# EAGLE design NanoLogger_V2 (EAGLE 6.1)
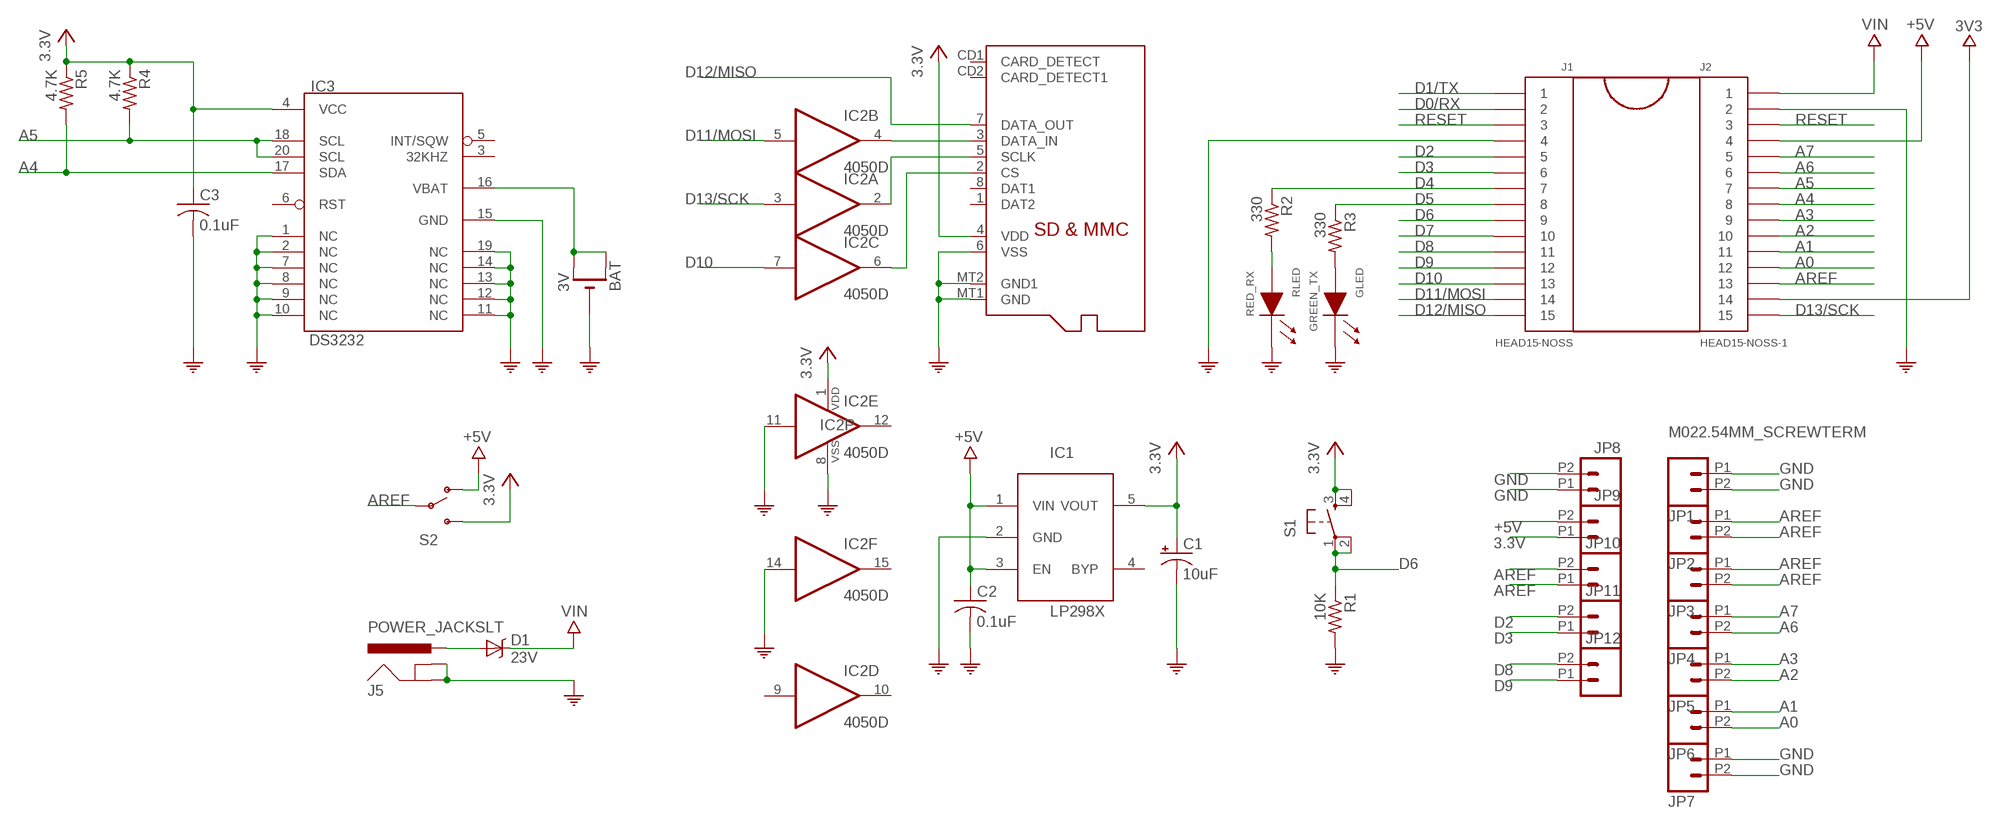
[diagram p0: schematic, sheet 1]

## Parts
BAT  3V  CR1220SMT  [CR1220-SMD]
C1  10uF  CPOL-USA/3216-18R  [A/3216-18R]
C2  0.1uF  C-USC0805K  [C0805K]
C3  0.1uF  C-USC0805K  [C0805K]
D1  23V  BAT20JFILM  [SOD-323]
GLED  GREEN_TX  LED0805  [LED0805]
IC1  LP298XS  [SOT23-5L]
IC2  4050D  [SO16]
IC3  DS3232  [SO20L]
J1  HEAD15-NOSS  [HEAD15-NOSS]
J2  HEAD15-NOSS-1  [HEAD15-NOSS-1]
J5  POWER_JACKSLT  [POWER_JACK_SLOT]
JP1  M022.54MM_SCREWTERM  [1X02_2.54_SCREWTERM]
JP2  M022.54MM_SCREWTERM  [1X02_2.54_SCREWTERM]
JP3  M022.54MM_SCREWTERM  [1X02_2.54_SCREWTERM]
JP4  M022.54MM_SCREWTERM  [1X02_2.54_SCREWTERM]
JP5  M022.54MM_SCREWTERM  [1X02_2.54_SCREWTERM]
JP6  M022.54MM_SCREWTERM  [1X02_2.54_SCREWTERM]
JP7  M022.54MM_SCREWTERM  [1X02_2.54_SCREWTERM]
JP8  M022.54MM_SCREWTERM  [1X02_2.54_SCREWTERM]
JP9  M022.54MM_SCREWTERM  [1X02_2.54_SCREWTERM]
JP10  M022.54MM_SCREWTERM  [1X02_2.54_SCREWTERM]
JP11  M022.54MM_SCREWTERM  [1X02_2.54_SCREWTERM]
JP12  M022.54MM_SCREWTERM  [1X02_2.54_SCREWTERM]
R1  10K  R-US_R0805  [R0805]
R2  330  R-US_R0805  [R0805]
R3  330  R-US_R0805  [R0805]
R4  4.7K  R-US_R0805  [R0805]
R5  4.7K  R-US_R0805  [R0805]
RLED  RED_RX  LED0805  [LED0805]
S1  TAC_SWITCHSMD  [TACTILE_SWITCH_SMD]
S2  SWITCH-SPDTPTH  [SWITCH-SPDT]
X1  MICROSD  [MICROSD]

## Nets
3.3V: C1.+ C3.1 IC1.5(VOUT) IC2.1(P:VDD) IC3.4(VCC) JP9.P1 R4.1 R5.1 S1.3 S1.4 S2.3(S) X1.4(VDD)
3V3: J2.14
+5V: C2.1 IC1.1(VIN) IC1.3(EN) J2.4 JP9.P2 S2.1(O)
A0: J2.12 JP6.P2
A1: J2.11 JP6.P1
A2: J2.10 JP5.P2
A3: J2.9 JP5.P1
A4: IC3.17(SDA) J2.8 R5.2
A5: IC3.18(SCL) IC3.20(SCL) J2.7 R4.2
A6: J2.6 JP4.P2
A7: J2.5 JP4.P1
AREF: J2.13 JP2.P1 JP2.P2 JP3.P1 JP3.P2 JP10.P1 JP10.P2 S2.2(P)
BAT_POWER: D1.2(A) J5.PWR
D0/RX: J1.2
D1/TX: J1.1
D2: J1.5 JP11.P2
D3: J1.6 JP11.P1
D4: J1.7 R2.1
D5: J1.8 R3.1
D6: J1.9 R1.1 S1.1 S1.2
D7: J1.10
D8: J1.11 JP12.P2
D9: J1.12 JP12.P1
D10: IC2.7(C:I) J1.13
D11/MOSI: IC2.5(B:I) J1.14
D12/MISO: J1.15 X1.7(DATA_OUT)
D13/SCK: IC2.3(A:I) J2.15
GND: BAT.- C1.- C2.2 C3.2 GLED.1(CA) IC1.2(GND) IC2.8(P:VSS) IC2.11(E:I) IC2.14(F:I) IC3.1(NC) IC3.2(NC) IC3.7(NC) IC3.8(NC) IC3.9(NC) IC3.10(NC) IC3.11(NC) IC3.12(NC) IC3.13(NC) IC3.14(NC) IC3.15(GND) IC3.19(NC) J1.4 J2.2 J5.GND@1(GNDBREAK) J5.GND@2(GND) JP1.P1 JP1.P2 JP7.P1 JP7.P2 JP8.P1 JP8.P2 R1.2 RLED.1(CA) X1.6(VSS) X1.MT1(GND) X1.MT2(GND1) ; supply symbol labelled COM
N$2: IC2.2(A:O) X1.5(SCLK)
N$3: IC2.6(C:O) X1.2(CS)
N$5: IC2.4(B:O) X1.3(DATA_IN)
N$6: GLED.2(AN) R3.2
N$7: R2.2 RLED.2(AN)
RESET: J1.3 J2.3
VBAT: BAT.+$1(+) BAT.+$2(+1) IC3.16(VBAT)
VIN: D1.1(C) J2.1
Unconnected: IC1.4(BYP) IC2.9(D:I) IC2.10(D:O) IC2.12(E:O) IC2.15(F:O) IC3.3(32KHZ) IC3.5(INT/SQW) IC3.6(RST) X1.1(DAT2) X1.8(DAT1) X1.CD1(CARD_DETECT) X1.CD2(CARD_DETECT1)

## Library data of the parts
BAT = adafruit:CR1220: CR1216/CR1220/CR1225 12mm 3V lithium coin cell Great for battery packup. Both SMT and THM holders. Note the THM package has the ground pads on both sides of the PCB so that the masks are the same - this reduces the cost
C1 = adafruit:CPOL-US: POLARIZED CAPACITOR, American symbol
C2 C3 = adafruit:C-US: CAPACITOR, American symbol
D1 = SparkFun-DiscreteSemi:BAT20JFILM: 23V, 1A Schottky diode, SOD-323 package; PROD_ID: DIO-11623; VALUE: BAT20JFILM
GLED RLED = MySMD:LED0805
IC1 = adafruit:LP298X
IC2 = 40xx:4050: Hex non-inverting BUFFER
IC3 = freetronics-master-v1:DS3232: DS3232 Extremely Accurate I2C RTC with Integrated Crystal and SRAM
J1 = MyCON2:HEAD15-NOSS
J2 = MyCON2:HEAD15-NOSS-1
J5 = SparkFun-Connectors:POWER_JACK: Power Jack This is the standard 5.5mm barrel jack for power. The PTH is the most common, proven, reliable, footprint. The Slot footprint only works if the mill layer is transmitted to the PCB fab house so be warned. Spark Fun Electronics SKU : PRT-00119 SMT: CONN-08106 Mating wall wart : TOL-00298 (and others)
JP1-JP12 = SparkFun-Connectors:M02: Standard 2-pin 0.1" header. Use with - straight break away headers ( PRT-00116) - right angle break away headers (PRT-00553) - swiss pins (PRT-00743) - machine pins (PRT-00117) - female headers (PRT-00115) Molex polarized connector foot print use with: PRT-08233 with associated crimp pins and housings. 2.54_SCREWTERM for use with PRT-10571. 3.5mm Screw Terminal footprints for PRT-08084 5mm Screw Terminal footprints for use with PRT-08433
R1-R5 = adafruit:R-US_: RESISTOR, American symbol
S1 = SparkFun-Electromechanical:TAC_SWITCH: Momentary Switch Button commonly used for reset or general input. Spark Fun Electronics SKU : COM-00097 SMT- SWCH-08247; PROD_ID: SWCH-08247
S2 = Sparkfun SPDT Switch slider COM-0960:SWITCH-SPDT: SPDT Switch Simple slide switch, Spark Fun Electronics SKU : COM-00102 DPDT SMT slide switch, AYZ0202, SWCH-08179
X1 = adafruit:MICROSD: Micro-SD / Transflash card holder with SPI pinout For the 3M # 2908-05WB-MG and/or 4UCON #19656 push-push type

## Net classes
0 default: width 0.305 mm, clearance 0.305 mm
1 GND: width 0.305 mm, clearance 0.305 mm
2 +5V: width 0.406 mm, clearance 0.305 mm
3 3.3V: width 0.406 mm, clearance 0.305 mm
4 3V3: width 0.406 mm, clearance 0.305 mm
5 BAT_POWER: width 0.406 mm, clearance 0.305 mm

## Board
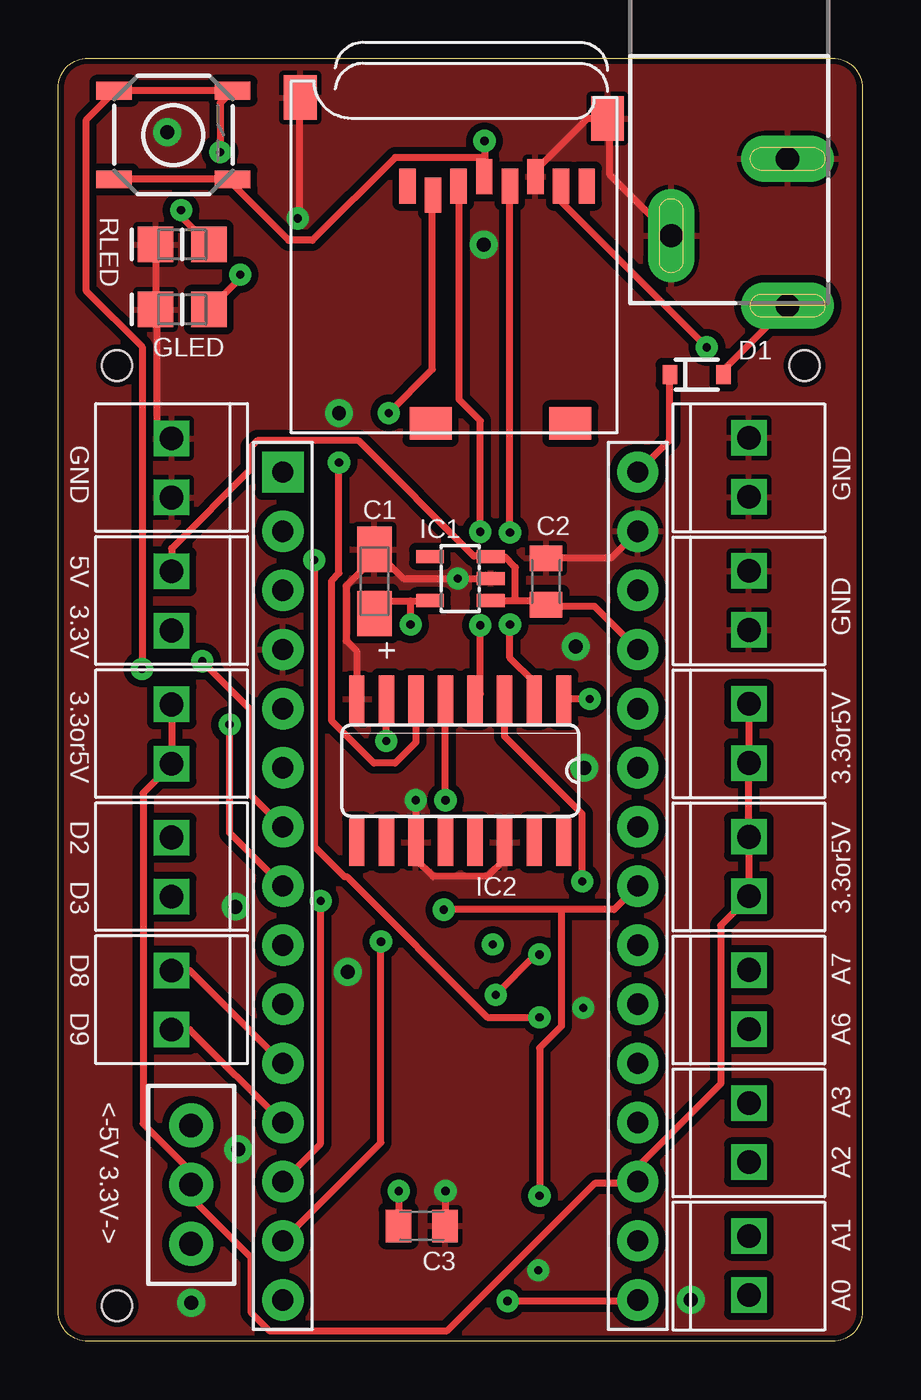
[diagram p1: board, top side]
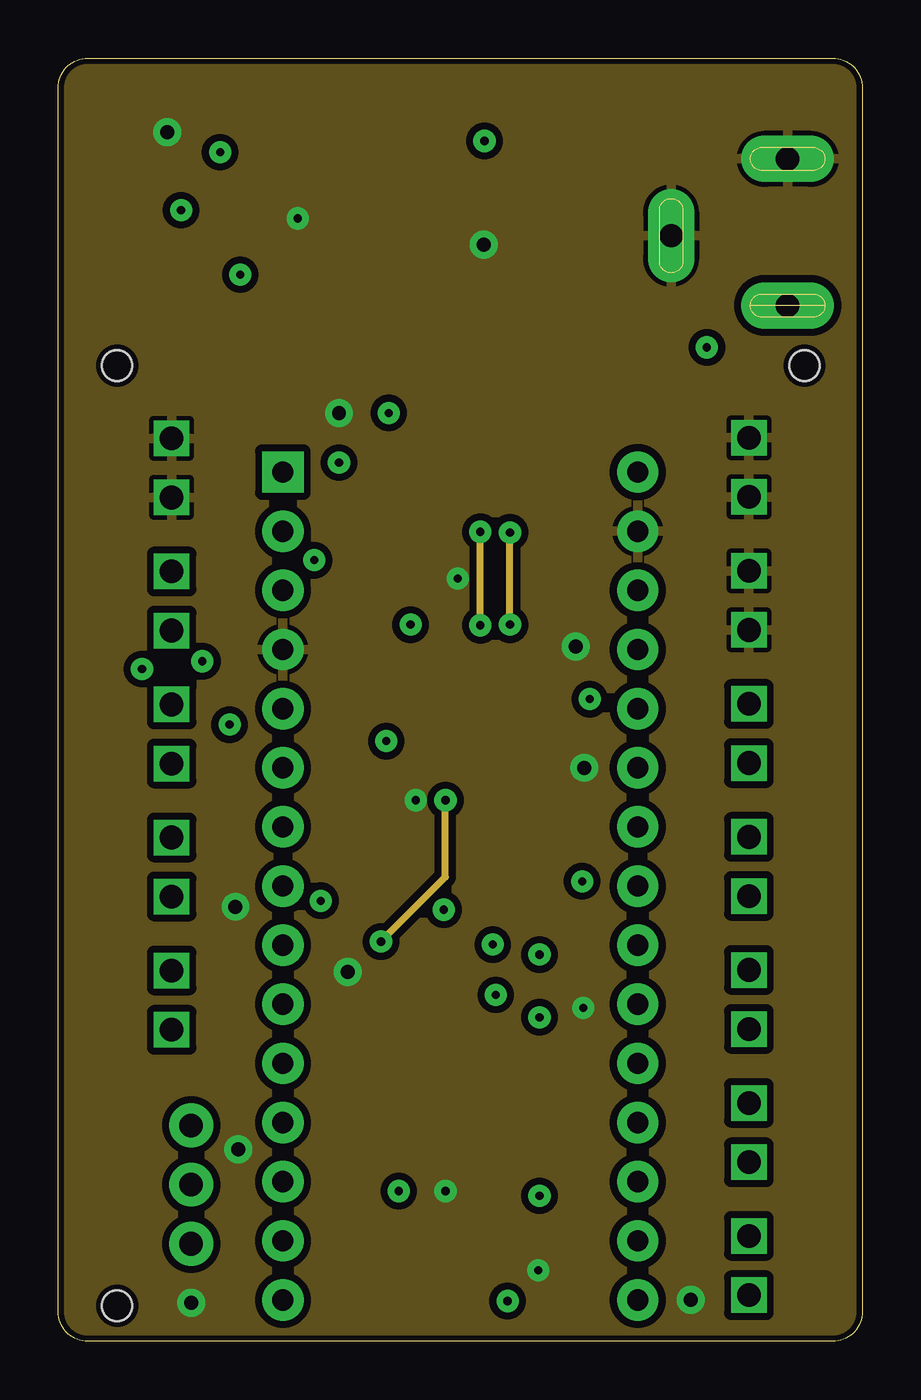
[diagram p2: board, inner layer Route2]
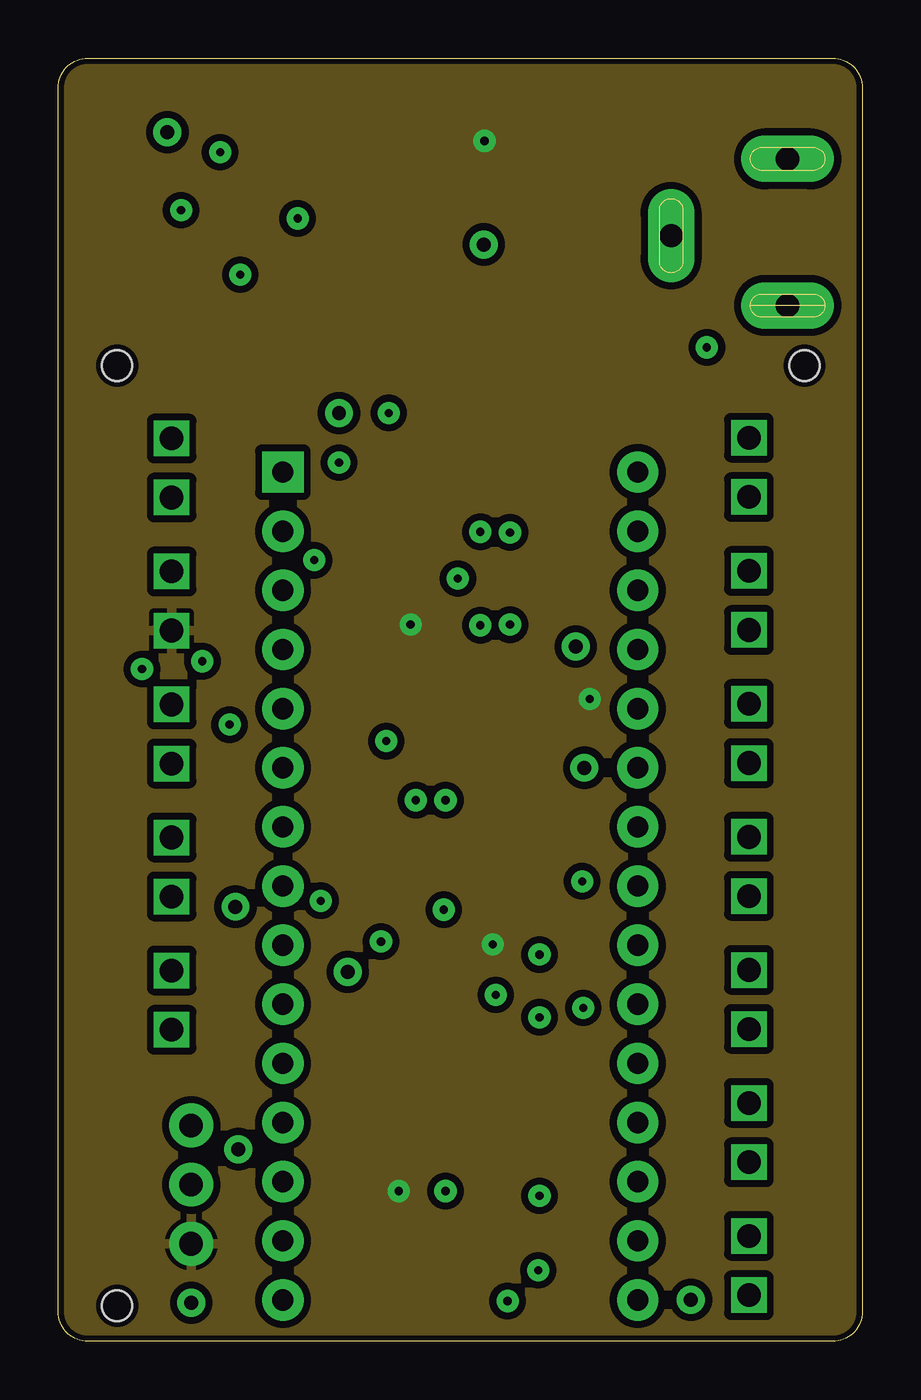
[diagram p3: board, inner layer Route3]
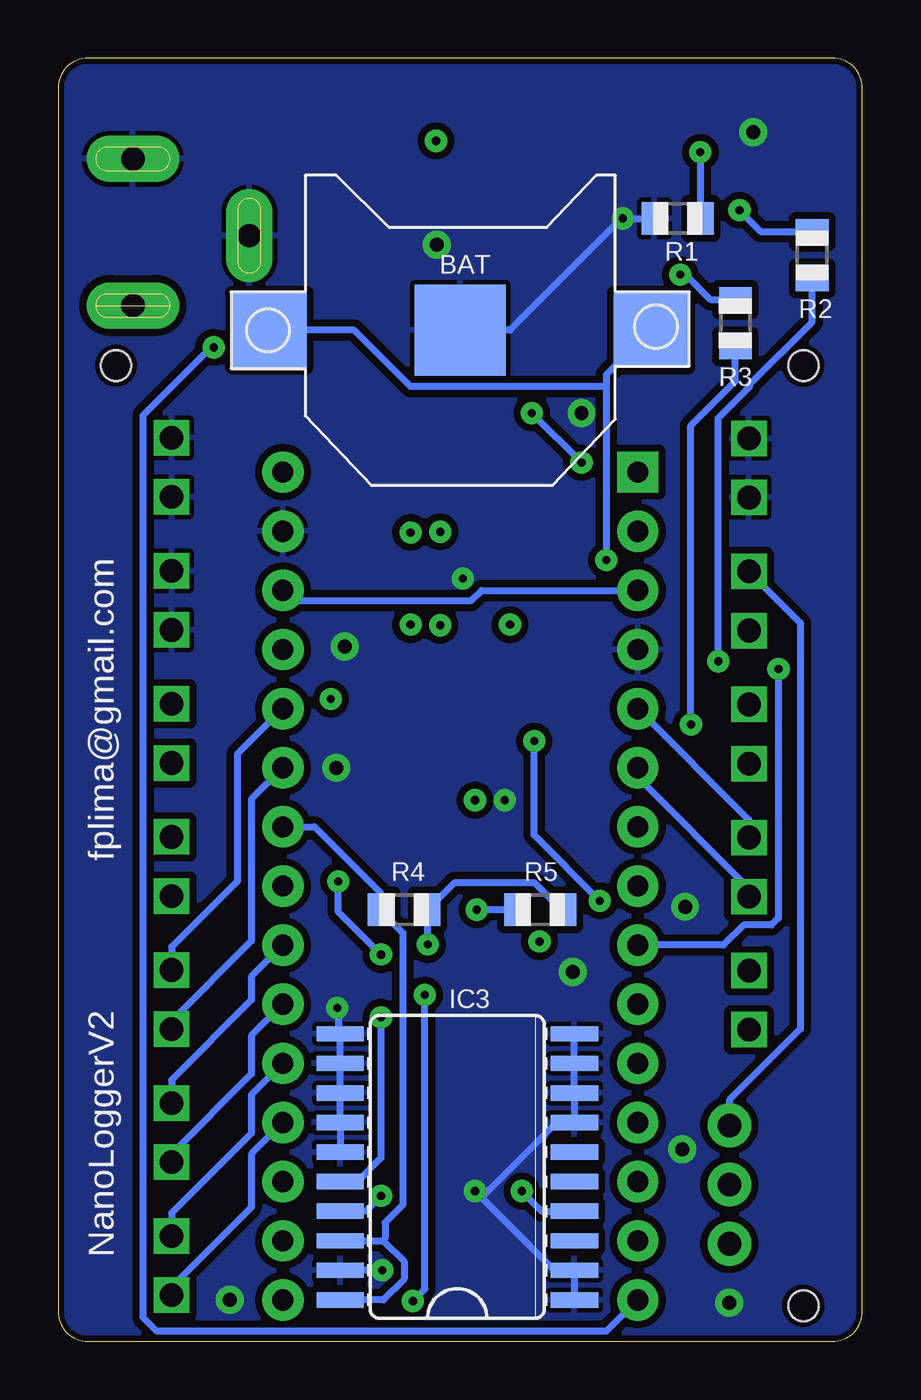
[diagram p4: board, bottom side, seen from below]

Size 34.53 x 55.12 mm. Coordinates in mm from the lower left corner, seen from the top.
Outline: 1.27,55.12 33.26,55.12 arc-90 34.53,53.85 34.53,1.27 arc-90 33.26,0 1.27,0 arc-90 0,1.27 0,53.85 arc-90 1.27,55.12
Copper layers (1+2*3+16): Top 0.018mm / dielectric 0.36mm / Route2 0.035mm / dielectric 0.71mm / Route3 0.035mm / dielectric 0.36mm / Bottom 0.018mm
Design rules: minimum track width 0.15mm, minimum drill 0.35mm, track to track 0.15mm, track to pad 0.15mm, pad to pad 0.15mm, via to via 0.15mm, smd to smd 0mil, copper to edge 0.25mm, drill to drill 0.35mm, minimum pad ring 0.2mm, minimum via ring 0.3mm, stop-mask expansion 0mil, vias tented up to drill 0.45mm, thermal gap 0.2mm
Holes 1.3 mm at 2.53,1.52 32.05,41.91 2.53,41.91

### Footprints (pad centres in the part's own frame; a part is rotated, then mirrored left to right if it is on the bottom)
CR1220-SMD = smd 3.2 x 3.2: +$1 -8.2,0; +$2 8.2,0 | smd 3.9 x 3.9: - 0,0
A/3216-18R = smd 1.95 x 1.5: + 1.375,0; - -1.375,0
C0805K = smd 1.1 x 1.4: 1 -1,0; 2 1,0
SOD-323 = smd 0.63 x 0.83: 1 -1.15,0; 2 1.15,0
LED0805 = smd 1.524 x 1.524: 1 0,0; 2 2.286,0
SOT23-5L = smd 0.55 x 1.2: 1 -0.95,-1.3; 2 0,-1.3; 3 0.95,-1.3; 4 0.95,1.3; 5 -0.95,1.3
SO16 = smd 0.66 x 2.032: 1 -4.445,-3.073; 2 -3.175,-3.073; 3 -1.905,-3.073; 4 -0.635,-3.073; 5 0.635,-3.073; 6 1.905,-3.073; 7 3.175,-3.073; 8 4.445,-3.073; 9 4.445,3.073; 10 3.175,3.073; 11 1.905,3.073; 12 0.635,3.073; 13 -0.635,3.073; 14 -1.905,3.073; 15 -3.175,3.073; 16 -4.445,3.073
SO20L = smd 0.66 x 2.032: 1 -5.715,-5.029; 2 -4.445,-5.029; 3 -3.175,-5.029; 4 -1.905,-5.029; 5 -0.635,-5.029; 6 0.635,-5.029; 7 1.905,-5.029; 8 3.175,-5.029; 9 4.445,-5.029; 10 5.715,-5.029; 11 5.715,5.029; 12 4.445,5.029; 13 3.175,5.029; 14 1.905,5.029; 15 0.635,5.029; 16 -0.635,5.029; 17 -1.905,5.029; 18 -3.175,5.029; 19 -4.445,5.029; 20 -5.715,5.029
HEAD15-NOSS = drill 0.914 pad 1.778 square: 1 0,0 | drill 0.914 pad 1.778: 2 2.54,0; 3 5.08,0; 4 7.62,0; 5 10.16,0; 6 12.7,0; 7 15.24,0; 8 17.78,0; 9 20.32,0; 10 22.86,0; 11 25.4,0; 12 27.94,0; 13 30.48,0; 14 33.02,0; 15 35.56,0
HEAD15-NOSS-1 = drill 0.914 pad 1.778: 1 0,0; 2 2.54,0; 3 5.08,0; 4 7.62,0; 5 10.16,0; 6 12.7,0; 7 15.24,0; 8 17.78,0; 9 20.32,0; 10 22.86,0; 11 25.4,0; 12 27.94,0; 13 30.48,0; 14 33.02,0; 15 35.56,0
POWER_JACK_SLOT = drill 1 pad 2 long: GND@1 2.58,7.5; GND@2 7.58,10.8; PWR 2.58,13.8
1X02_2.54_SCREWTERM = drill 1.016 square: P1 2.54,0; P2 0,0
R0805 = smd 1.1 x 1.4: 1 -1,0; 2 1,0
TACTILE_SWITCH_SMD = smd 1.524 x 0.762: 1 -2.54,1.905; 2 2.54,1.905; 3 -2.54,-1.905; 4 2.54,-1.905
SWITCH-SPDT = drill 1.016 pad 1.88: 1 0,2.54; 2 0,0; 3 0,-2.54
MICROSD = smd 0.7 x 1.5: 1 9,-10.64; 2 7.9,-10.24; 3 6.8,-10.64; 4 5.7,-11.04; 5 4.6,-10.64; 6 3.5,-11.04; 7 2.4,-10.64; 8 1.3,-10.64 | smd 1.8 x 1.4: CD1 2,-0.44; CD2 8,-0.44 | smd 1.4 x 1.9: MT1 0.4,-13.54; MT2 13.6,-14.44

### Placement (x,y rotation side)
BAT  17.26,43.43 0 bottom
C1  13.58,32.64 270 top
C2  20.95,32.64 90 top
C3  15.61,4.95 0 top
D1  27.42,41.53 0 top
GLED  4.18,44.32 0 top
IC1  17.26,32.77 90 top
IC2  17.26,24.51 180 top
IC3  17.39,7.49 90 bottom
J1  9.64,37.34 270 top
J2  24.88,37.34 270 top
J5  33.9,58.29 180 top
JP1  29.66,36.27 90 top
JP2  29.66,24.84 90 top
JP3  29.66,19.13 90 top
JP4  29.66,13.41 90 top
JP5  29.66,7.7 90 top
JP6  29.66,1.98 90 top
JP7  29.66,30.56 90 top
JP8  4.87,38.79 270 top
JP9  4.87,33.07 270 top
JP10  4.87,27.36 270 top
JP11  4.87,21.64 270 top
JP12  4.87,15.93 270 top
R1  7.93,48.23 180 bottom
R2  2.15,46.66 90 bottom
R3  5.45,43.74 90 bottom
R4  19.68,18.54 180 bottom
R5  13.84,18.54 180 bottom
RLED  4.18,47.12 0 top
S1  4.95,51.82 0 top
S2  5.71,6.73 0 top
X1  24,38.99 180 top

### Tracks (layer width: path | path; a pad name or v marks a point on that pad's centre or on a via)
3.3V  (via drill 0.35)
  Top 0.305: 15.13,31.8 14.11,31.8 C1.+ | 15.13,31.8 15.94,31.8 IC1.5 | v14.62,6.45 14.62,4.95 C3.1 | v18.3,51.56 18.3,50.85 | 18.3,50.85 18.3,50.04 X1.4 | v22.83,27.58 IC2.1 | v15.13,30.79 15.13,31.8 | S1.3 S1.4 7.56,49.78 7.56,49.63 9.9,47.3 10.91,47.3 14.47,50.85 18.3,50.85
  Bottom 0.305: R5.1 12.92,18.54 14.09,19.71 17.49,19.71 18.66,18.54 R4.1 18.66,18.41 v18.66,17.04 | IC3.4 13.76,5.59 v14.62,6.45
  pour Route3: 0,55.12 34.53,55.12 34.53,0 0,0
+5V
  Top 0.305: 19.63,31.8 20.8,31.8 20.95,31.65 C2.1 21.07,31.57 23.03,31.57 J2.4 | 19.63,31.8 18.59,31.8 IC1.1 | 19.63,31.8 19.63,33.25 19.17,33.71 18.59,33.71 IC1.3 18.41,33.73 17.85,33.73 12.89,38.68 8.55,38.68 8.3,38.43 8.3,37.49 4.87,34.06 JP9.P2
  Bottom 0.305: S2.1 5.71,10.36 2.66,13.41 2.66,30.86 JP9.P2
A0
  Bottom 0.305: JP6.P2 29.66,2.34 26.23,5.77 26.23,8.05 J2.12
A1
  Bottom 0.305: JP6.P1 29.66,5.51 26.23,8.94 26.23,10.59 J2.11
A2
  Bottom 0.305: JP5.P2 29.66,8.05 26.23,11.48 26.23,13.13 J2.10
A3
  Bottom 0.305: JP5.P1 29.66,11.23 26.23,14.66 26.23,15.67 J2.9
A4  (via drill 0.35)
  Top 0.305: 21.61,18.54 23.87,18.54 J2.8 | 21.61,18.54 v16.55,18.54 | v20.67,6.25 20.67,12.6 21.61,13.54 21.61,18.54
  Bottom 0.305: v16.55,18.54 R5.2 | IC3.17 21.33,5.59 v20.67,6.25
A5
  Bottom 0.305: IC3.20 20.57,1.78 19.68,2.67 19.68,3.43 20.57,4.32 | IC3.18 20.57,4.32 | J2.7 23.51,22.1 20.69,19.28 20.69,18.54 R4.2 20.59,18.41 19.73,17.55 19.73,5.87 20.49,5.1 20.49,4.44 20.57,4.32
A6
  Bottom 0.305: JP4.P2 29.66,13.77 26.23,17.2 26.23,23.29 J2.6
A7
  Bottom 0.305: JP4.P1 29.66,16.94 26.84,19.76 26.84,25.22 J2.5
AREF
  Top 0.305: JP10.P2 JP10.P1 4.79,24.69 3.65,23.55 3.65,9.35 5.71,7.29 S2.2 5.78,6.6 5.78,6.1 8.3,3.58 8.3,1.22 9.09,0.43 16.68,0.43 23.03,6.78 24.76,6.78 J2.13 24.88,7.49 28.44,11.05 28.44,17.86 29.58,19 JP3.P2 JP3.P1 JP2.P2 JP2.P1
BAT_POWER
  Top 0.305: D1.2 28.59,41.53 28.59,41.76 31.31,44.48 J5.PWR
D2
  Bottom 0.305: JP11.P2 4.87,22.4 J1.5
D3
  Bottom 0.305: JP11.P1 4.87,19.46 9.64,24.23 J1.6
D4  (via drill 0.35)
  Top 0.305: v6.19,29.21 8.3,27.1 8.3,23.44 J1.7
  Bottom 0.305: R2.1 2.15,43.79 4.84,41.1 4.84,41 6.19,39.65 v6.19,29.21
D5  (via drill 0.35)
  Top 0.305: v7.36,26.49 7.36,21.84 J1.8
  Bottom 0.305: R3.1 5.45,41.25 7.36,39.35 v7.36,26.49
D6  (via drill 0.35)
  Top 0.305: v6.95,51.08 6.95,53.19 S1.2 S1.1 2.33,53.59 1.19,52.45 1.19,45.14 3.6,42.72 v3.6,28.88
  Bottom 0.305: v6.95,51.08 6.95,48.23 R1.1 | J1.9 5.96,17.02 5.1,17.88 3.9,17.88 3.6,18.19 v3.6,28.88
D8
  Top 0.305: JP12.P2 5.66,15.93 J1.11
D9
  Top 0.305: JP12.P1 5.66,13.39 J1.12
D10  (via drill 0.35)
  Top 0.305: v14.09,25.78 IC2.7 | v11.27,18.92 11.27,8.48 J1.13
  Bottom 0.305: v14.09,25.78 14.09,21.74 v11.27,18.92
D11/MOSI  (via drill 0.35)
  Top 0.305: v16.63,23.24 IC2.5 | v13.86,17.17 13.86,8.53 J1.14
  Route2 0.305: v16.63,23.24 16.63,19.94 v13.86,17.17
D12/MISO  (via drill 0.35)
  Top 0.305: v27.86,42.7 21.61,48.95 21.61,49.61 X1.7
  Bottom 0.305: v27.86,42.7 27.96,42.7 30.88,39.78 30.88,1.02 30.29,0.43 10.99,0.43 J1.15
D13/SCK  (via drill 0.35)
  Top 0.305: IC2.3 19.17,25.98 22.5,22.66 v22.5,19.76 | v20.67,16.61 20.52,16.61 v18.79,14.88 | v19.3,1.73 24.83,1.73 J2.15
  Bottom 0.305: v22.5,19.76 22.5,18.44 v20.67,16.61 | v18.79,14.88 18.79,2.24 v19.3,1.73
GND  (via drill 0.35, 0.6 pad 0.25)
  Top 0.305: IC1.2 v17.16,32.77 14.83,32.77 C1.- 13.66,33.73 12.36,32.44 12.36,30.1 12.82,29.64 IC2.8 | X1.6 20.52,50.04 20.52,50.32 22.73,52.53 23.59,52.53 X1.MT1 23.69,52.4 23.69,50.11 26.31,47.5 J5.GND@2 | IC2.14 19.17,20.7 18.43,19.96 16.1,19.96 15.36,20.7 IC2.11 v15.36,23.24 | RLED.1 GLED.1 4.26,44.2 4.26,39.4 JP8.P2 | v16.63,6.45 16.63,4.95 C3.2 | J2.2 23.74,33.66 20.95,33.66 C2.2 | v10.28,48.23 10.38,48.34 10.38,53.42 X1.MT2
  Bottom 0.305: IC3.15 IC3.14 IC3.13 IC3.12 IC3.11 22.5,13.34 22.5,14.28 v22.55,14.33 | IC3.10 IC3.9 IC3.8 IC3.7 12.49,9.32 13.2,9.32 16.25,6.27 v16.63,6.45 13.3,3.12 12.49,3.12 IC3.2 IC3.1 | R1.2 v10.28,48.23 10.41,48.16 15.13,43.43 BAT.- | v20.62,3.05 IC3.19
  other vias: 5.71,1.65 22.6,24.64 7.61,18.67 12.44,15.88 22.22,29.84 4.69,51.94 18.28,47.12 7.74,8.26 12.06,39.88 27.17,1.78
  pour Route2: 0,55.12 34.53,55.12 34.53,0 0,0
  pour Top: 0,55.12 34.53,55.12 34.53,0 0,0
  pour Bottom: 0,55.12 34.53,55.12 34.53,0 0,0
N$2  (via drill 0.35)
  Top 0.305: v19.4,34.75 19.4,49.61 X1.5 | v19.4,30.79 19.4,29.36 20.44,28.32 IC2.2
  Route2 0.305: v19.4,30.79 v19.4,34.75
N$3  (via drill 0.35)
  Top 0.305: v14.19,39.88 16.07,41.76 16.07,49.23 X1.2 | v12.06,37.74 12.06,33 11.75,32.69 11.75,26.64 13.56,24.84 14.47,24.84 15.36,25.73 IC2.6
  Bottom 0.305: v12.06,37.74 v14.19,39.88
N$5  (via drill 0.35)
  Top 0.305: v18.13,34.77 18.13,39.55 17.21,40.46 17.21,49.61 X1.3 | v18.13,30.76 18.13,27.81 IC2.4
  Route2 0.305: v18.13,30.76 v18.13,34.77
N$6  (via drill 0.35)
  Top 0.305: v7.82,45.82 7.82,45.67 GLED.2
  Bottom 0.305: v7.82,45.82 7.59,45.82 6.52,44.76 5.45,44.76 R3.2
N$7  (via drill 0.35)
  Top 0.305: v5.28,48.59 5.28,48.31 RLED.2
  Bottom 0.305: v5.28,48.59 4.36,47.68 2.15,47.68 R2.2
RESET
  Bottom 0.305: J1.3 16.35,32.26 16.78,31.83 24.45,31.83 J2.3
VBAT  (via drill 0.35)
  Top 0.305: v20.67,13.92 18.43,13.92 12.39,19.96 12.29,19.96 10.99,21.26 v10.99,33.55
  Bottom 0.305: IC3.16 21.68,6.86 20.67,7.87 v20.67,13.92 | 10.99,41.02 10.99,41.53 9.09,43.43 BAT.+$2 | 10.99,41.02 v10.99,33.55 | BAT.+$1 21.81,43.43 19.4,41.02 10.99,41.02
VIN
  Top 0.305: J2.1 26.26,38.71 26.26,41.53 D1.1

### Text on the board
tNames: GND | GND | 5V | GND | 3.3V | 3.3or5V | 3.3or5V | D2 | 3.3or5V | D3 | D8 | A7 | D9 | A6 | <-5V 3.3V-> | A3 | A2 | A1 | A0
bNames: fplima@gmail.com | NanoLoggerV2